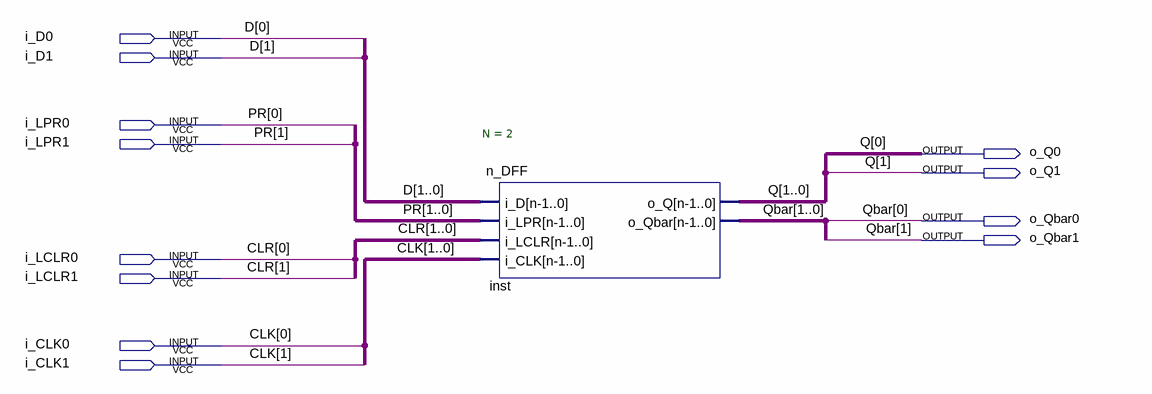
[diagram p0: schematic sheet]
// Quartus schematic DualDFF.bdf as structural Verilog: 1 symbols, 12 pins
module DualDFF (
  input  i_D0,
  input  i_D1,
  input  i_LPR0,
  input  i_LPR1,
  input  i_LCLR0,
  input  i_LCLR1,
  input  i_CLK0,
  input  i_CLK1,
  output o_Q0,
  output o_Q1,
  output o_Qbar0,
  output o_Qbar1
);

  n_DFF #(.N(2)) inst (
    .i_D({i_D1, i_D0}), .i_LPR({i_LPR1, i_LPR0}), .i_LCLR({i_LCLR1, i_LCLR0}), .i_CLK({i_CLK1, i_CLK0}),
    .o_Q({o_Q1, o_Q0}), .o_Qbar({o_Qbar1, o_Qbar0}));

  // Other names for the same wires on the sheet: CLK[1:0] = {i_CLK1, i_CLK0}; CLR[1:0] = {i_LCLR1, i_LCLR0};
  //   D[1:0] = {i_D1, i_D0}; PR[1:0] = {i_LPR1, i_LPR0}; Q[1:0] = {o_Q1, o_Q0}; Qbar[1:0] = {o_Qbar1, o_Qbar0}
endmodule
